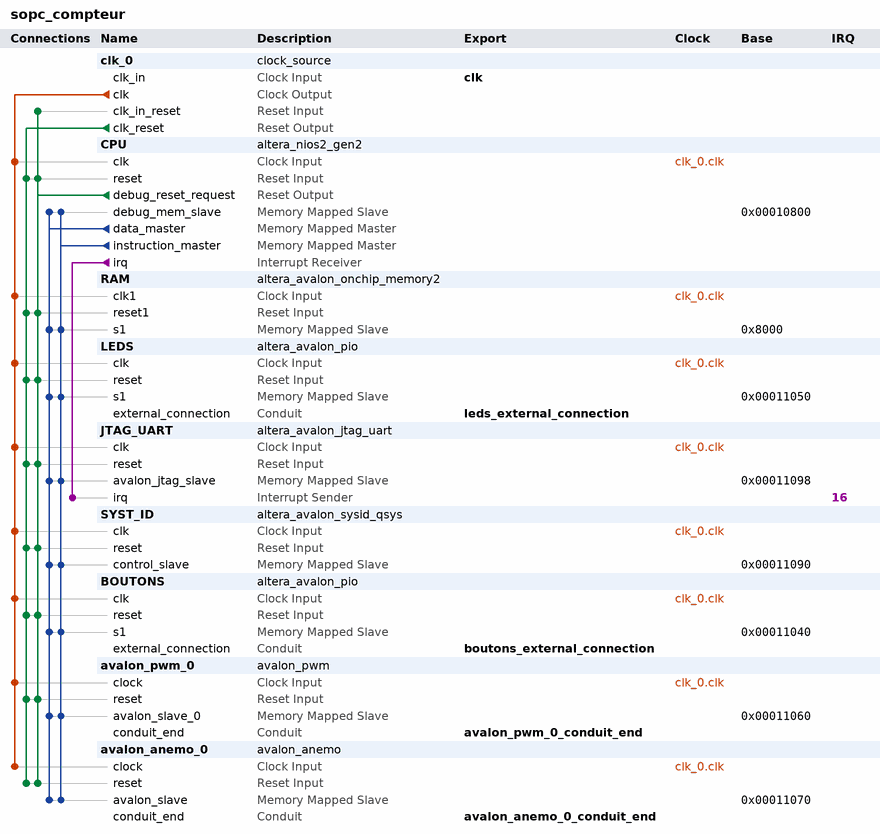
[diagram p0: system contents]
# Platform Designer (Qsys) system sopc_compteur, Cyclone IV E EP4CE22F17C6
# Parameters at their usual value, and those the tool derives, are not listed.
package require -exact qsys 18.1
create_system sopc_compteur
set_project_property DEVICE_FAMILY {Cyclone IV E}
set_project_property DEVICE EP4CE22F17C6

add_instance clk_0 clock_source 18.1
set_instance_parameter_value clk_0 clockFrequency 50000000

add_instance CPU altera_nios2_gen2 18.1
set_instance_parameter_value CPU dcache_size 2048
set_instance_parameter_value CPU exceptionSlave RAM.s1
set_instance_parameter_value CPU icache_size 4096
set_instance_parameter_value CPU impl Tiny
set_instance_parameter_value CPU resetSlave RAM.s1

add_instance RAM altera_avalon_onchip_memory2 18.1
set_instance_parameter_value RAM dataWidth 32
set_instance_parameter_value RAM dualPort false
set_instance_parameter_value RAM initMemContent true
set_instance_parameter_value RAM initializationFileName onchip_mem.hex
set_instance_parameter_value RAM memorySize 20480

add_instance LEDS altera_avalon_pio 18.1
set_instance_parameter_value LEDS direction Output
set_instance_parameter_value LEDS width 8

add_instance JTAG_UART altera_avalon_jtag_uart 18.1
set_instance_parameter_value JTAG_UART simInteractiveOptions NO_INTERACTIVE_WINDOWS

add_instance SYST_ID altera_avalon_sysid_qsys 18.1
set_instance_parameter_value SYST_ID id 0

add_instance BOUTONS altera_avalon_pio 18.1
set_instance_parameter_value BOUTONS direction Input
set_instance_parameter_value BOUTONS width 2

add_instance avalon_pwm_0 avalon_pwm 1.0

add_instance avalon_anemo_0 avalon_anemo 1.0

# connections
add_connection clk_0.clk avalon_anemo_0.clock clock
add_connection clk_0.clk avalon_pwm_0.clock clock
add_connection clk_0.clk BOUTONS.clk clock
add_connection clk_0.clk CPU.clk clock
add_connection clk_0.clk JTAG_UART.clk clock
add_connection clk_0.clk LEDS.clk clock
add_connection clk_0.clk RAM.clk1 clock
add_connection clk_0.clk SYST_ID.clk clock
add_connection clk_0.clk_reset avalon_anemo_0.reset reset
add_connection clk_0.clk_reset avalon_pwm_0.reset reset
add_connection clk_0.clk_reset BOUTONS.reset reset
add_connection clk_0.clk_reset CPU.reset reset
add_connection clk_0.clk_reset JTAG_UART.reset reset
add_connection clk_0.clk_reset LEDS.reset reset
add_connection clk_0.clk_reset RAM.reset1 reset
add_connection clk_0.clk_reset SYST_ID.reset reset
add_connection CPU.debug_reset_request avalon_anemo_0.reset reset
add_connection CPU.debug_reset_request avalon_pwm_0.reset reset
add_connection CPU.debug_reset_request BOUTONS.reset reset
add_connection CPU.debug_reset_request clk_0.clk_in_reset reset
add_connection CPU.debug_reset_request CPU.reset reset
add_connection CPU.debug_reset_request JTAG_UART.reset reset
add_connection CPU.debug_reset_request LEDS.reset reset
add_connection CPU.debug_reset_request RAM.reset1 reset
add_connection CPU.debug_reset_request SYST_ID.reset reset
add_connection CPU.data_master avalon_anemo_0.avalon_slave avalon
set_connection_parameter_value CPU.data_master/avalon_anemo_0.avalon_slave baseAddress 0x00011070
add_connection CPU.data_master avalon_pwm_0.avalon_slave_0 avalon
set_connection_parameter_value CPU.data_master/avalon_pwm_0.avalon_slave_0 baseAddress 0x00011060
add_connection CPU.data_master BOUTONS.s1 avalon
set_connection_parameter_value CPU.data_master/BOUTONS.s1 baseAddress 0x00011040
add_connection CPU.data_master CPU.debug_mem_slave avalon
set_connection_parameter_value CPU.data_master/CPU.debug_mem_slave baseAddress 0x00010800
add_connection CPU.data_master JTAG_UART.avalon_jtag_slave avalon
set_connection_parameter_value CPU.data_master/JTAG_UART.avalon_jtag_slave baseAddress 0x00011098
add_connection CPU.data_master LEDS.s1 avalon
set_connection_parameter_value CPU.data_master/LEDS.s1 baseAddress 0x00011050
add_connection CPU.data_master RAM.s1 avalon
set_connection_parameter_value CPU.data_master/RAM.s1 baseAddress 0x8000
add_connection CPU.data_master SYST_ID.control_slave avalon
set_connection_parameter_value CPU.data_master/SYST_ID.control_slave baseAddress 0x00011090
add_connection CPU.instruction_master avalon_anemo_0.avalon_slave avalon
set_connection_parameter_value CPU.instruction_master/avalon_anemo_0.avalon_slave baseAddress 0x00011070
add_connection CPU.instruction_master avalon_pwm_0.avalon_slave_0 avalon
set_connection_parameter_value CPU.instruction_master/avalon_pwm_0.avalon_slave_0 baseAddress 0x00011060
add_connection CPU.instruction_master BOUTONS.s1 avalon
set_connection_parameter_value CPU.instruction_master/BOUTONS.s1 baseAddress 0x00011040
add_connection CPU.instruction_master CPU.debug_mem_slave avalon
set_connection_parameter_value CPU.instruction_master/CPU.debug_mem_slave baseAddress 0x00010800
add_connection CPU.instruction_master JTAG_UART.avalon_jtag_slave avalon
set_connection_parameter_value CPU.instruction_master/JTAG_UART.avalon_jtag_slave baseAddress 0x00011098
add_connection CPU.instruction_master LEDS.s1 avalon
set_connection_parameter_value CPU.instruction_master/LEDS.s1 baseAddress 0x00011050
add_connection CPU.instruction_master RAM.s1 avalon
set_connection_parameter_value CPU.instruction_master/RAM.s1 baseAddress 0x8000
add_connection CPU.instruction_master SYST_ID.control_slave avalon
set_connection_parameter_value CPU.instruction_master/SYST_ID.control_slave baseAddress 0x00011090
add_connection CPU.irq JTAG_UART.irq interrupt
set_connection_parameter_value CPU.irq/JTAG_UART.irq irqNumber 16

# exported interfaces
add_interface avalon_anemo_0_conduit_end conduit end
set_interface_property avalon_anemo_0_conduit_end EXPORT_OF avalon_anemo_0.conduit_end
add_interface avalon_pwm_0_conduit_end conduit end
set_interface_property avalon_pwm_0_conduit_end EXPORT_OF avalon_pwm_0.conduit_end
add_interface boutons_external_connection conduit end
set_interface_property boutons_external_connection EXPORT_OF BOUTONS.external_connection
add_interface clk clock sink
set_interface_property clk EXPORT_OF clk_0.clk_in
add_interface leds_external_connection conduit end
set_interface_property leds_external_connection EXPORT_OF LEDS.external_connection

set_interconnect_requirement {$system} qsys_mm.clockCrossingAdapter HANDSHAKE
set_interconnect_requirement {$system} qsys_mm.enableEccProtection FALSE
set_interconnect_requirement {$system} qsys_mm.insertDefaultSlave FALSE
set_interconnect_requirement {$system} qsys_mm.maxAdditionalLatency 1

save_system sopc_compteur.qsys
